# Altium schematic sheet container.SchDoc
size A4
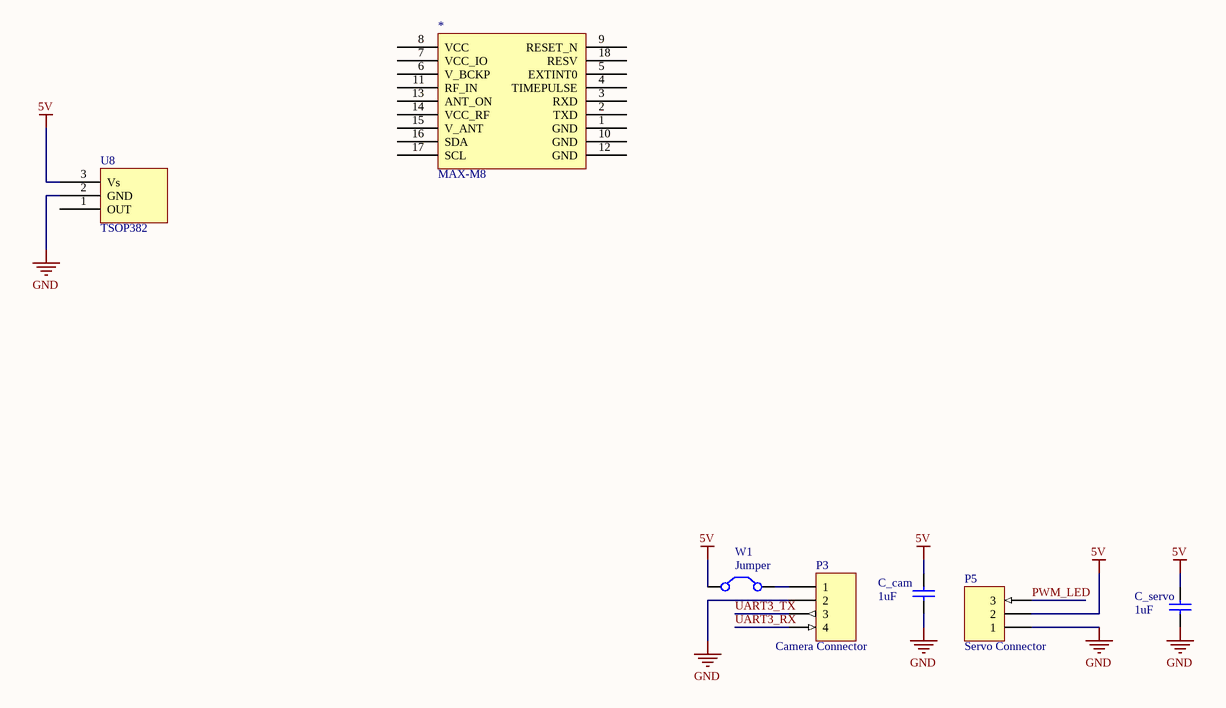
[diagram p0: container.SchDoc]

## Parts
*  MAX-M8
C_cam  value 1uF  [1608[0603]]  (hidden comment: Cap Semi)
C_servo  value 1uF  [1608[0603]]  (hidden comment: Cap Semi)
P3  Camera Connector  [HDR1X4]
P5  Servo Connector  [HDR1X3]
U8  TSOP382
W1  Jumper  [RAD-0.2]

## Nets
5V: C_cam.1 C_servo.1 P5.2 U8.3(Vs) W1.1(C1)
GND: C_cam.2 C_servo.2 P3.2 P5.1 U8.2(GND)
PWM_LED: P5.3
UART3_RX: P3.4
UART3_TX: P3.3
NetP3_1: P3.1 W1.2(C2)

Not connected (* = marked no-connect by the designer): * 1(GND) 2(TXD) 3(RXD) 4(TIMEPULSE) 5(EXTINT0) 6(V_BCKP) 7(VCC_IO) 8(VCC) 9(RESET_N) 10(GND) 11(RF_IN) 12(GND) 13(ANT_ON) 14(VCC_RF) 15(V_ANT) 16(SDA) 17(SCL) 18(RESV); U8 1(OUT)

## Library data of the parts
C_cam C_servo = Cap Semi: Capacitor (Semiconductor SIM Model); Published: 8-Jun-2000; LatestRevisionDate: 29-May-2009; LatestRevisionNote: IPC-7351 Footprint Added.; PackageReference: C1206; Publisher: Altium Limited; PackageDescription: Chip Capacitor
P3 = Header 4: Header, 4-Pin; LatestRevisionDate: 17-Jul-2002; LatestRevisionNote: Re-released for DXP Platform.; Publisher: Altium Limited
P5 = Header 3: Header, 3-Pin; LatestRevisionDate: 17-Jul-2002; LatestRevisionNote: Re-released for DXP Platform.; Publisher: Altium Limited
W1 = Jumper: Jumper Wire; Published: 24-Mar-1999; LatestRevisionDate: 17-Jul-2002; LatestRevisionNote: Re-released for DXP Platform.; PackageReference: RAD-0.2; Publisher: Altium Limited; PackageDescription: Radial Cap, Thru-Hole; 2 Leads; 0.2 in Pin Spacing